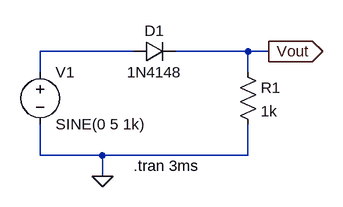
[diagram p0: schematic TransientAnalysis.asc]
TransientAnalysis.asc, the LTspice schematic file:
Version 4
SHEET 1 880 680
WIRE 128 80 -16 80
WIRE 304 80 192 80
WIRE 336 80 304 80
WIRE -16 112 -16 80
WIRE 304 112 304 80
WIRE -16 240 -16 192
WIRE 80 240 -16 240
WIRE 304 240 304 192
WIRE 304 240 80 240
WIRE 80 272 80 240
FLAG 80 272 0
FLAG 336 80 Vout
IOPIN 336 80 Out
SYMBOL diode 128 96 R270
WINDOW 0 32 32 VTop 2
WINDOW 3 0 32 VBottom 2
SYMATTR InstName D1
SYMATTR Value 1N4148
SYMBOL res 288 96 R0
SYMATTR InstName R1
SYMATTR Value 1k
SYMBOL voltage -16 96 R0
WINDOW 123 0 0 Left 0
WINDOW 39 0 0 Left 0
SYMATTR InstName V1
SYMATTR Value SINE(0 5 1k)
TEXT 128 256 Left 2 !.tran 3ms

The netlist it stands for:
* TransientAnalysis.asc
D1 N001 Vout 1N4148
R1 Vout 0 1k
V1 N001 0 SINE(0 5 1k)
.model D D
.lib standard.dio
.tran 3ms
.backanno
.end